# Altium schematic sheet 07_USB.SchDoc
size 420 x 297 mm; SheetNumber: 14; SheetTotal: 28
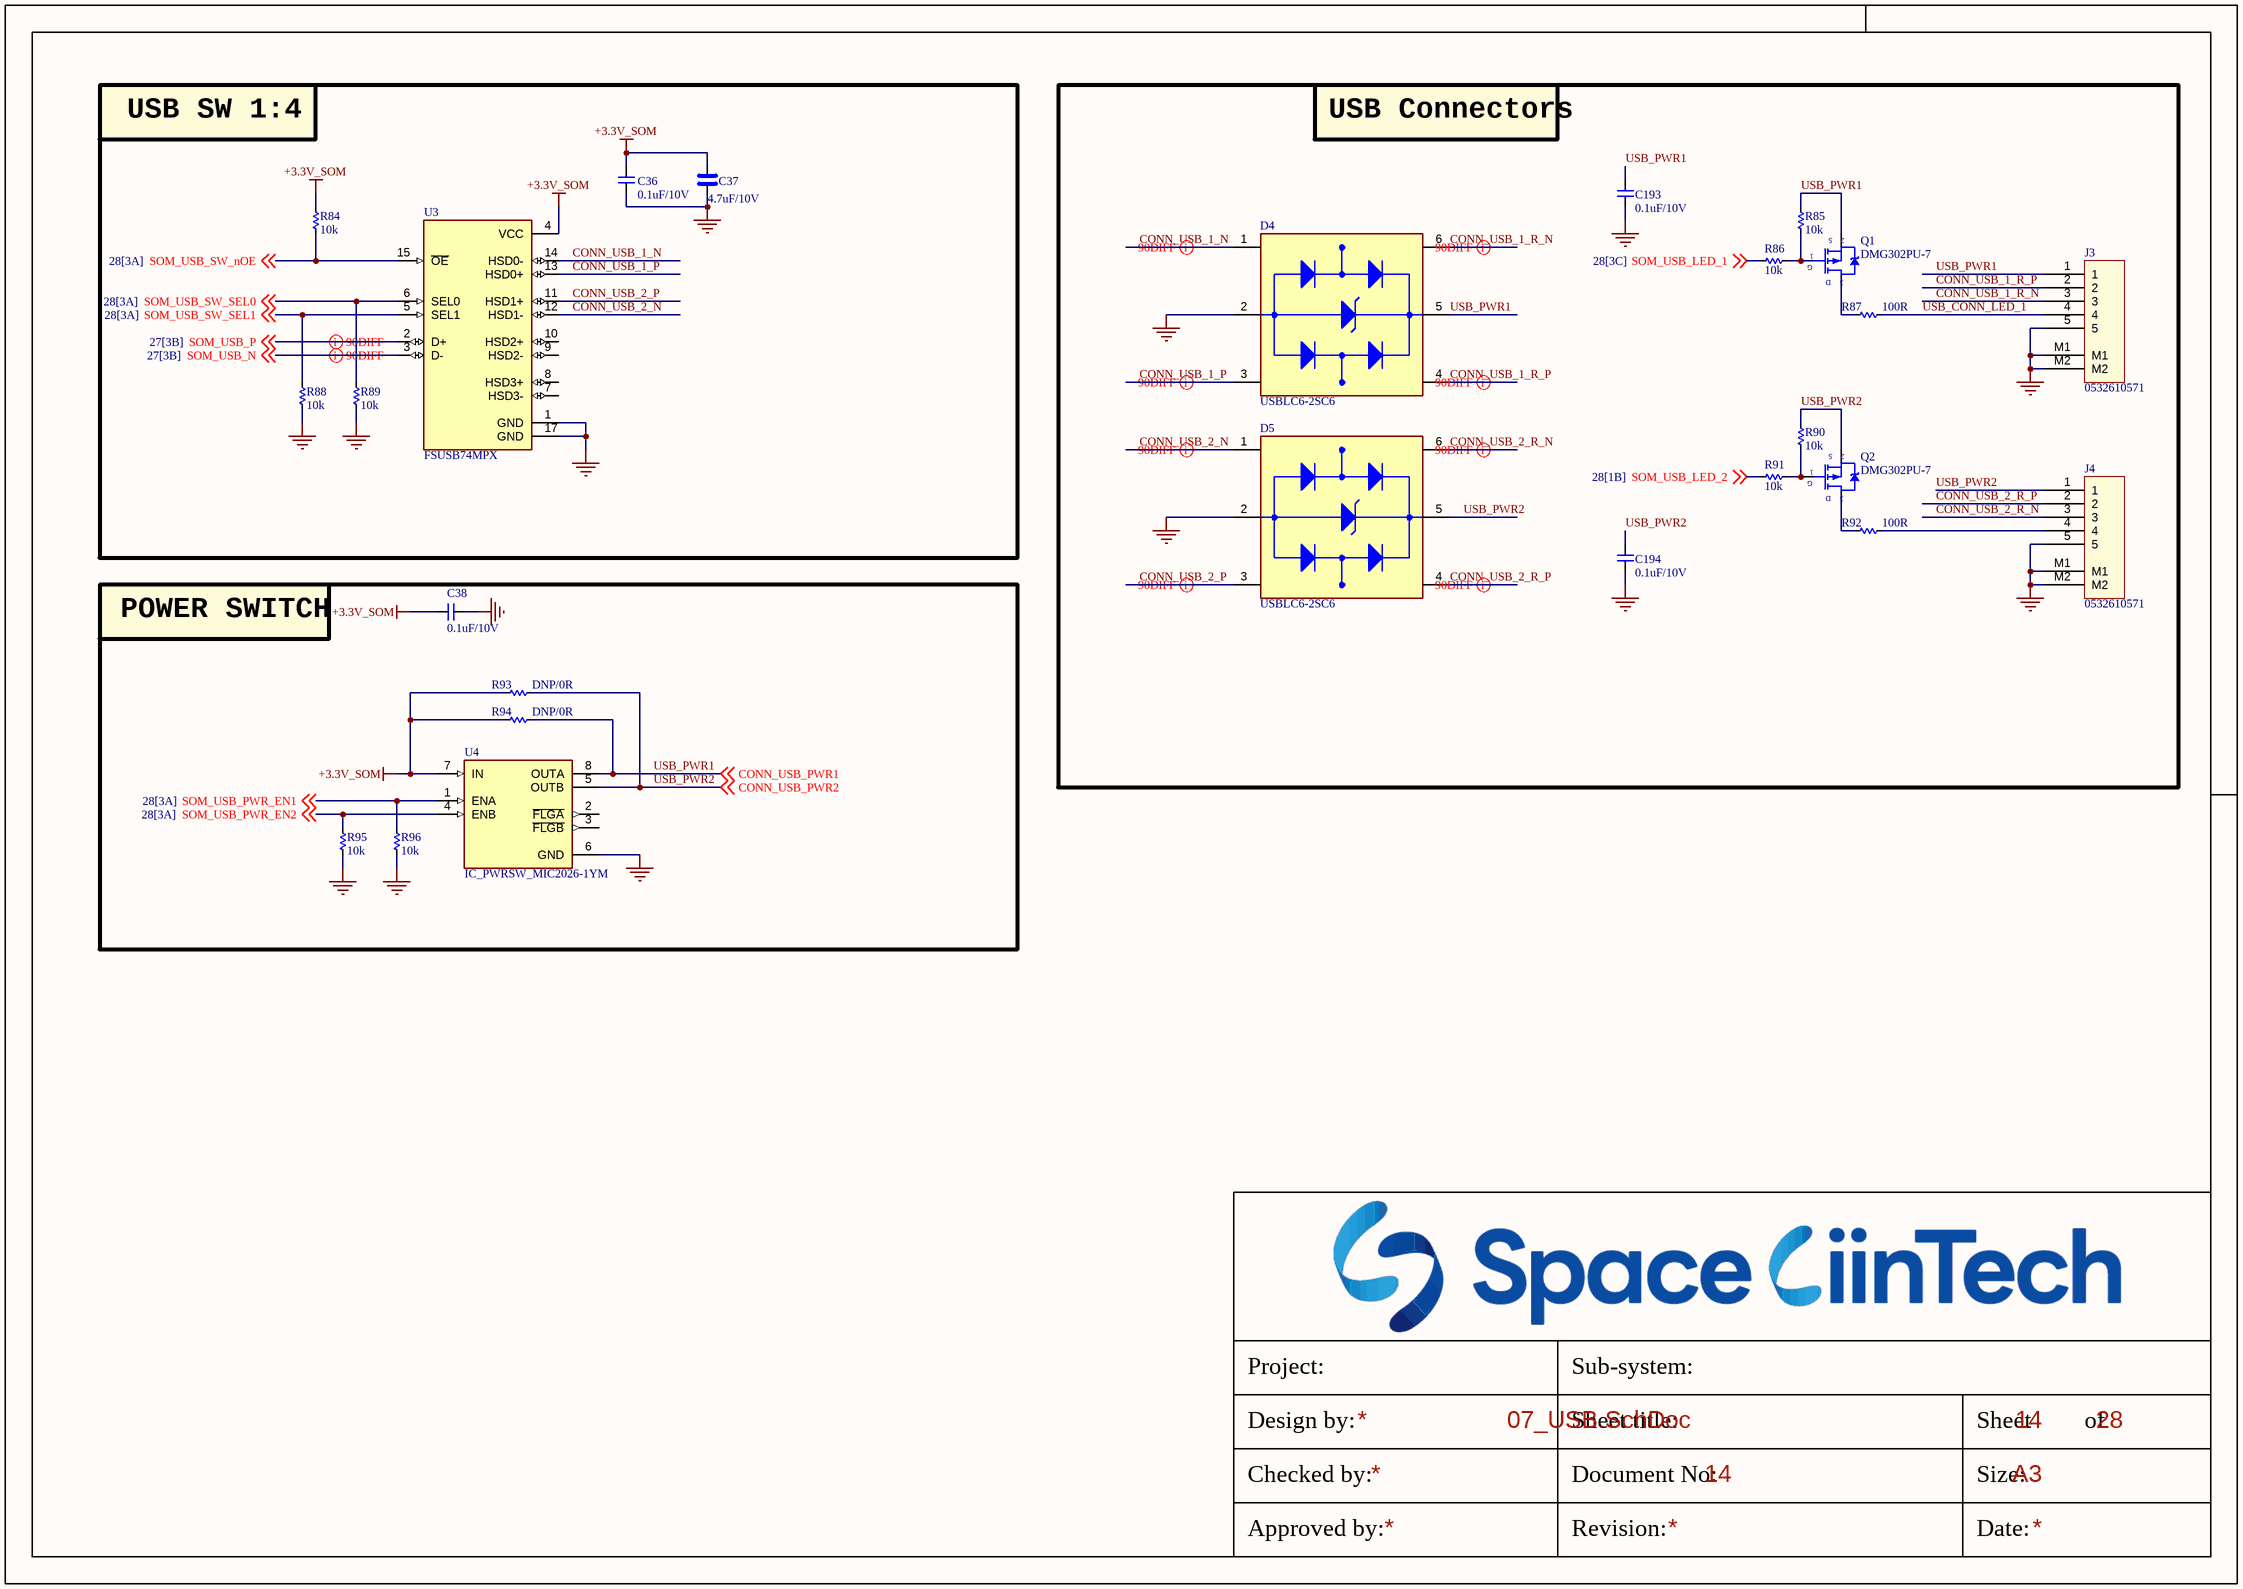
[diagram p0: 07_USB.SchDoc]

## Parts
C36  0.1uF/10V  [CAP_C_1005X60]
C37  4.7uF/10V  [CAP_C_1005X60]
C38  0.1uF/10V  [CAP_C_1005X60]
C193  0.1uF/10V  [CAP_C_1005X60]
C194  0.1uF/10V  [CAP_C_1005X60]
D4  USBLC6-2SC6  [SOT95P280X145-6N]
D5  USBLC6-2SC6  [SOT95P280X145-6N]
J3  0532610571  [MOLEX_0532610571]
J4  0532610571  [MOLEX_0532610571]
Q1  DMG302PU-7  [SOT95P240X120-3N]
Q2  DMG302PU-7  [SOT95P240X120-3N]
R84  10k  [RES_C_1005X40]
R85  10k  [RES_C_1005X40]
R86  10k  [RES_C_1005X40]
R87  100R  [RES_C_1005X40]
R88  10k  [RES_C_1005X40]
R89  10k  [RES_C_1005X40]
R90  10k  [RES_C_1005X40]
R91  10k  [RES_C_1005X40]
R92  100R  [RES_C_1005X40]
R93  DNP/0R  [RES_C_1005X40]
R94  DNP/0R  [RES_C_1005X40]
R95  10k  [RES_C_1005X40]
R96  10k  [RES_C_1005X40]
U3  FSUSB74MPX  [QFN50P300X300X80-17N]
U4  IC_PWRSW_MIC2026-1YM  [SOIC127P602X173-8N]

## Blocks framed on the sheet
USB SW 1:4: C36 C37 R84 R88 R89 U3
USB Connectors: C193 C194 D4 D5 J3 J4 Q1 Q2 R85-R87 R90-R92
POWER SWITCH: C38 R93-R96 U4

## Nets
+3.3V_SOM: C36.2 C37.2 C38.2 R84.1 R93.2 R94.2 U3.4(VCC) U4.7(IN)
GND: C36.1 C37.1 C38.1 C193.1 C194.1 D4.2(GND) D5.2(GND) J3.5 J3.M1 J3.M2 J4.5 J4.M1 J4.M2 R88.2 R89.2 R95.2 R96.2 U3.1(GND) U3.17(GND) U4.6(GND)
CONN_USB_1_N: D4.1(I/O1_IN) U3.14(HSD0-)
CONN_USB_1_P: D4.3(I/O2_IN) U3.13(HSD0+)
CONN_USB_1_R_N: D4.6(I/O1_OUT) J3.3
CONN_USB_1_R_P: D4.4(I/O2_OUT) J3.2
CONN_USB_2_N: D5.1(I/O1_IN) U3.12(HSD1-)
CONN_USB_2_P: D5.3(I/O2_IN) U3.11(HSD1+)
CONN_USB_2_R_N: D5.6(I/O1_OUT) J4.3
CONN_USB_2_R_P: D5.4(I/O2_OUT) J4.2
SOM_USB_LED_1: R86.1 ; off-sheet SOM_USB_LED_1
SOM_USB_LED_2: R91.1 ; off-sheet SOM_USB_LED_2
SOM_USB_N: U3.3(D-) ; off-sheet SOM_USB_N
SOM_USB_P: U3.2(D+) ; off-sheet SOM_USB_P
SOM_USB_PWR_EN1: R96.1 U4.1(ENA) ; off-sheet SOM_USB_PWR_EN1
SOM_USB_PWR_EN2: R95.1 U4.4(ENB) ; off-sheet SOM_USB_PWR_EN2
SOM_USB_SW_nOE: R84.2 U3.15(~{OE}) ; off-sheet SOM_USB_SW_nOE
SOM_USB_SW_SEL0: R89.1 U3.6(SEL0) ; off-sheet SOM_USB_SW_SEL0
SOM_USB_SW_SEL1: R88.1 U3.5(SEL1) ; off-sheet SOM_USB_SW_SEL1
USB_CONN_LED_1: J3.4 R87.2
USB_PWR1: C193.2 D4.5(VBUS) J3.1 Q1.2(S) R85.1 R94.1 U4.8(OUTA) ; off-sheet CONN_USB_PWR1  [also labelled CONN_USB_PWR1]
USB_PWR2: C194.2 D5.5(VBUS) J4.1 Q2.2(S) R90.1 R93.1 U4.5(OUTB) ; off-sheet CONN_USB_PWR2  [also labelled CONN_USB_PWR2]
NetJ4_4: J4.4 R92.2
NetQ1_1: Q1.1(G) R85.2 R86.2
NetQ1_3: Q1.3(D) R87.1
NetQ2_1: Q2.1(G) R90.2 R91.2
NetQ2_3: Q2.3(D) R92.1

Not connected (* = marked no-connect by the designer): U3 7(HSD3-) 8(HSD3+) 9(HSD2-) 10(HSD2+); U4 2(~{FLGA}) 3(~{FLGB})

## Layout directives
differential pair; differential pair class DIFF90: CONN_USB_1_N, CONN_USB_1_P, CONN_USB_1_R_N, CONN_USB_1_R_P, CONN_USB_2_N, CONN_USB_2_P, CONN_USB_2_R_N, CONN_USB_2_R_P, SOM_USB_N, SOM_USB_P

## Notes on the sheet
- Project:
- Sub-system:
- Design by:
- Sheet title:
- Sheet
- of
- Checked by:
- Approved by:
- Revision:
- Document No:
- Size:
- Date:
- A3

## Library data of the parts
C36 C38 C193 C194 = _CAP_C_2: CAP CHIP
C37 = _CAP_C_High_2: CAP CHIP High Value
D4 D5 = USBLC6-2SC6: 17V Clamp 5A (8/20Âµs) Ipp Tvs Diode Surface Mount SOT-23-6; MF: STMicroelectronics; Value: *; SnapEDA_Link: https://www.snapeda.com/parts/USBLC6-2SC6/STMicroelectronics/view-part/?ref=snap; Check_prices: https://www.snapeda.com/parts/USBLC6-2SC6/STMicroelectronics/view-part/?ref=eda; Purchase-URL: https://pricing.snapeda.com/search/part/USBLC6-2SC6/?ref=eda; Price: None; Availability: In Stock; Package: SOT-23-6 STMicroelectronics; MP: USBLC6-2SC6
J3 J4 = Header 5x1_2M
Q1 Q2 = MOSFET_P_GSD
R84-R96 = _RES_B_2: RES
U3 = IC_USB_SW_FSUSB74MPX: USB Switch IC 1 Channel 16-MLP (3x3); MF: ON Semiconductor; SnapEDA_Link: https://www.snapeda.com/parts/FSUSB74MPX/Onsemi/view-part/?ref=snap; Package: WQFN-16 ON Semiconductor; Value: *; MP: FSUSB74MPX; Check_prices: https://www.snapeda.com/parts/FSUSB74MPX/Onsemi/view-part/?ref=eda
U4 = IC_PWRSW_MIC2026-1YM: Power Switch/Driver 1:2 N-Channel 1.25A 8-SOIC; MF: Microchip; SnapEDA_Link: https://www.snapeda.com/parts/MIC2026-1YM/Microchip/view-part/?ref=snap; Package: SO-8 Microchip; Value: *; MP: MIC2026-1YM; Check_prices: https://www.snapeda.com/parts/MIC2026-1YM/Microchip/view-part/?ref=eda